# EAGLE design ESP_NeoPixel (EAGLE 9.2.0)
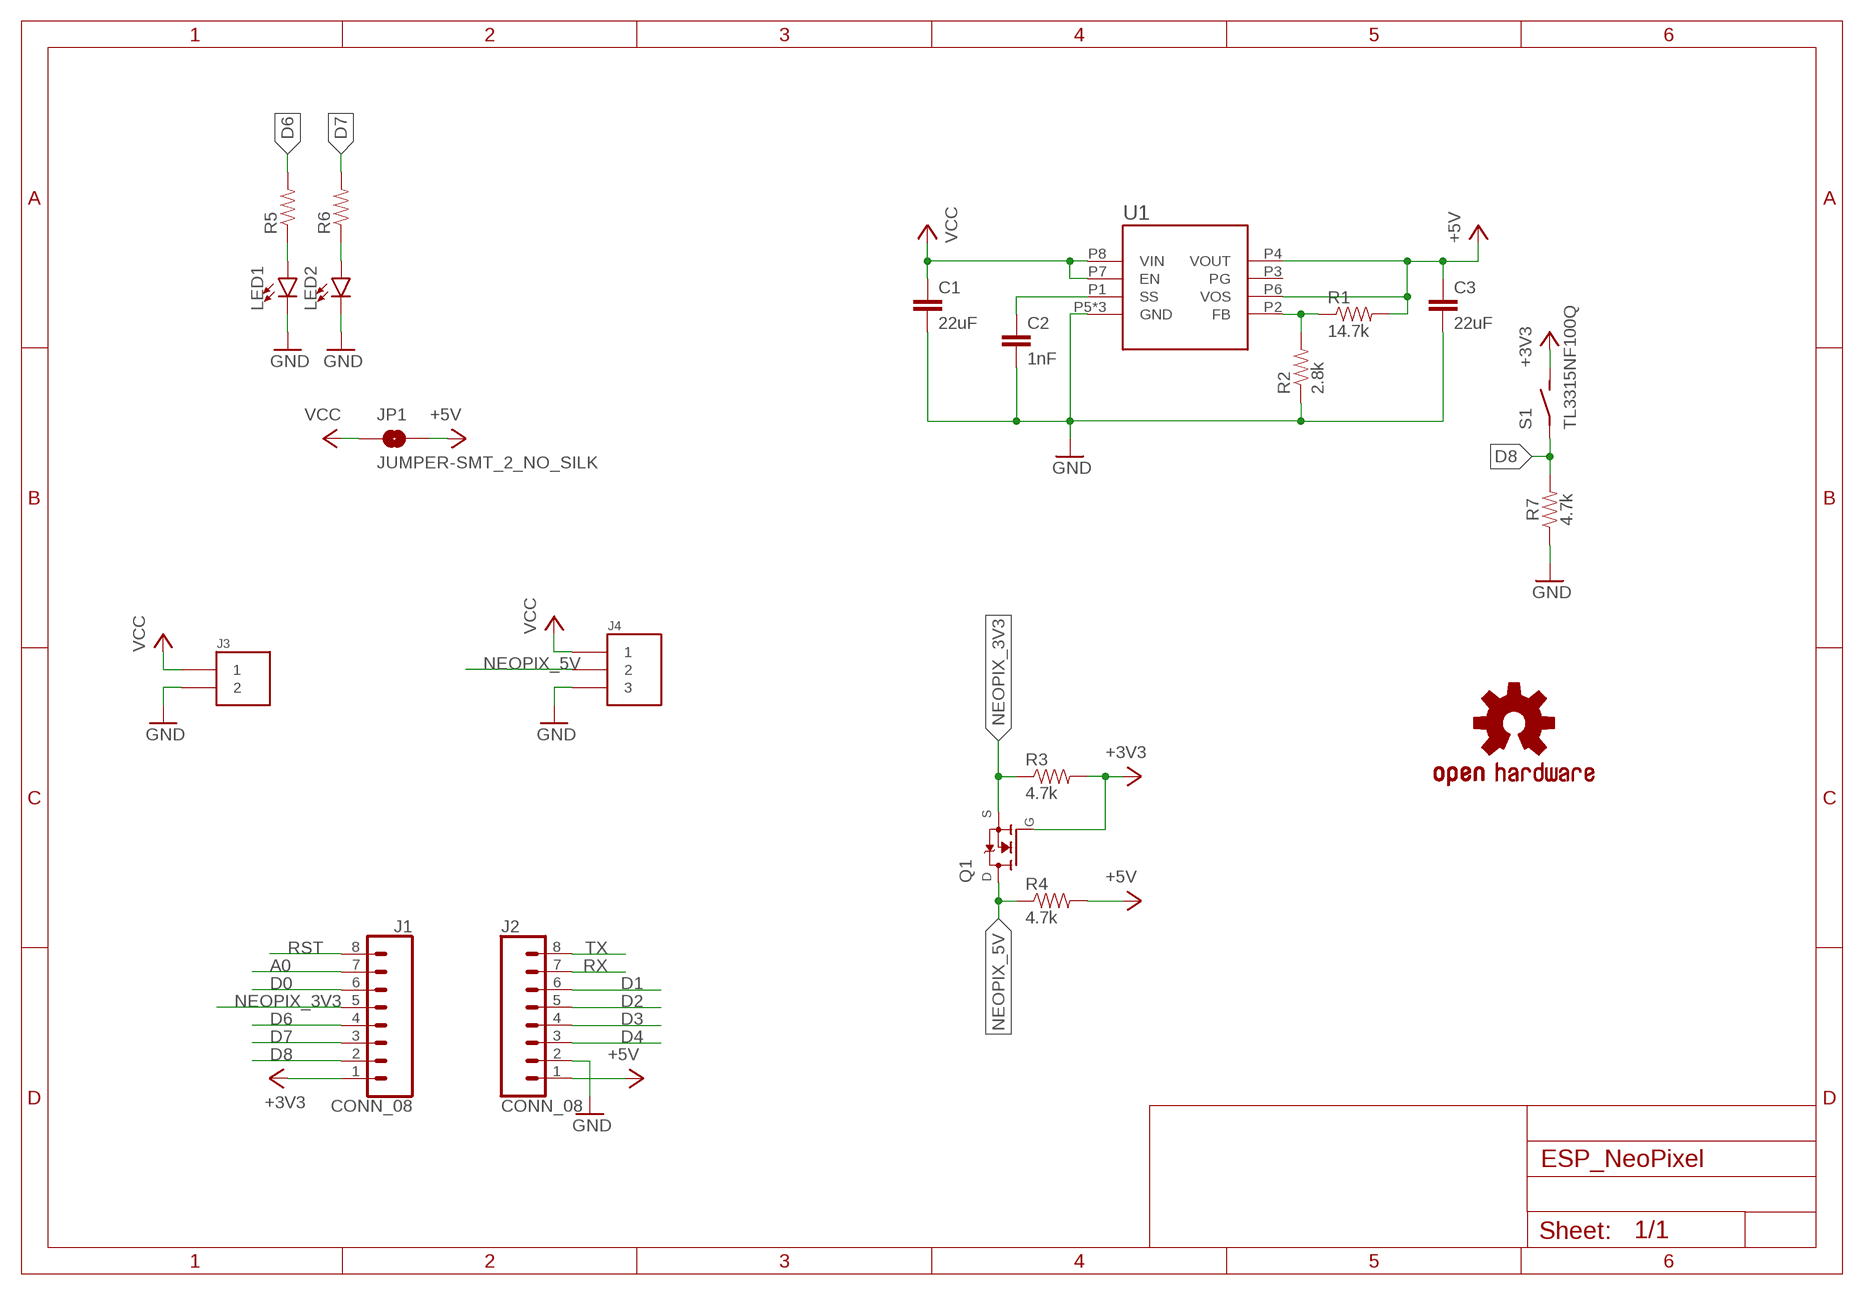
[diagram p0: schematic, sheet 1]

## Parts
C1  22uF  22UF-0805-6.3V-20%  [0805]
C2  1nF  1.0NF/1000PF-0603-50V-10%  [0603]
C3  22uF  22UF-0805-6.3V-20%  [0805]
J1  CONN_08  [1X08_LOCK_NO_SILK]
J2  CONN_08  [1X08_LOCK_NO_SILK]
J3  MKDS3-2-5.00  [MKDS3-2-5.00]
J4  MKDS3-3-5.00  [MKDS3-3-5.00]
JP1  JUMPER-SMT_2_NO_SILK  [SMT-JUMPER_2_NO_SILK]
LED1  LED0603  [LED-0603]
LED2  LED0603  [LED-0603]
LOGO1  OSHW-LOGOS  [OSHW-LOGO-S]
Q1  BSN20,215  [BSN20_215]
R1  14.7k  RESISTOR0603  [0603]
R2  2.8k  RESISTOR0603  [0603]
R3  4.7k  4.7KOHM-0603-1/10W-1%  [0603]
R4  4.7k  4.7KOHM-0603-1/10W-1%  [0603]
R5  RESISTOR0603  [0603]
R6  RESISTOR0603  [0603]
R7  4.7k  RESISTOR0603  [0603]
S1  TL3315NF100Q  [TL3315NF100Q]
U1  LMZ21700  [SIL0008E]

## Nets
+3V3: J1.1 Q1.1(G) R3.2 S1.P3(S) S1.P4(S)
+5V: C3.1 J2.1 JP1.2 R1.2 R4.2 U1.P4(VOUT) U1.P6(VOS)
A0: J1.7
D0: J1.6
D1: J2.6
D2: J2.5
D3: J2.4
D4: J2.3
D6: J1.4 R5.2
D7: J1.3 R6.2
D8: J1.2 R7.2 S1.P1(P) S1.P2(P)
GND: C1.2 C2.2 C3.2 J2.2 J3.2 J4.3 LED1.C LED2.C R2.1 R7.1 U1.P5(GND) U1.P9(GND) U1.P10(GND)
N$1: R1.1 R2.2 U1.P2(FB)
N$2: C2.1 U1.P1(SS)
N$3: LED1.A R5.1
N$4: LED2.A R6.1
NEOPIX_3V3: J1.5 Q1.2(S) R3.1
NEOPIX_5V: J4.2 Q1.3(D) R4.1
RST: J1.8
RX: J2.7
TX: J2.8
VCC: C1.1 J3.1 J4.1 JP1.1 U1.P7(EN) U1.P8(VIN)
Unconnected: U1.P3(PG)

## Library data of the parts
C1 C3 = SparkFun-Capacitors:22UF: 22µF ceramic capacitors A capacitor is a passive two-terminal electrical component used to store electrical energy temporarily in an electric field.; PROD_ID: CAP-08402
C2 = SparkFun-Capacitors:1.0NF/1000PF: 1nF/1,000pF ceramic capacitors A capacitor is a passive two-terminal electrical component used to store electrical energy temporarily in an electric field.; PROD_ID: CAP-07886
J1 J2 = jonas_Sparkfun-Connectors:CONN_08
J3 = jonas-phoenix:MKDS3-2-5.00
J4 = jonas-phoenix:MKDS3-3-5.00
JP1 = SparkFun-Jumpers:JUMPER-SMT_2_NO: Normally open jumper This jumper has two pads in close proximity to each other. Apply solder to close the connection. Round pads are easier to solder for beginners, but are a lot larger. SparkFun Product that uses the round pads: SparkFun EL Sequencer <https://www.sparkfun.com/products/12781>
LED1 LED2 = SparkFun-LED:LED: LED (Generic) Standard schematic elements and footprints for 5mm, 3mm, 1206, and 0603 sized LEDs. Generic LEDs with no color specified.
LOGO1 = SparkFun-Aesthetics:OSHW-LOGO: Open-Source Hardware (OSHW) Logo This logo indicates the piece of hardware it is found on incorporates a OSHW license and/or adheres to the definition of open source hardware found here: http://freedomdefined.org/OSHW
Q1 = jonas_mosfet:BSN20,215: BSN20 N chan with source-drain diode handy for I2C voltage shifter; AVAILABILITY: Good; DESCRIPTION: BSN Series 50 V 15 Ohm 0.83 W N-Channel Enhancement Mode Transistor - SOT-23; MF: NXP Semiconductors; MP: BSN20,215; PACKAGE: TO-236 NXP Semiconductors; PRICE: 0.17 USD
R1 R2 R5-R7 = SparkFun-Resistors:RESISTOR: Generic Resistor Package
R3 R4 = SparkFun-Resistors:4.7KOHM: 4.7kΩ resistor A resistor is a passive two-terminal electrical component that implements electrical resistance as a circuit element. Resistors act to reduce current flow, and, at the same time, act to lower voltage levels within circuits. - Wikipedia; PROD_ID: RES-07857
S1 = jonas-switch:TL3315NF100Q
U1 = jonas_ti:LMZ21700

## Board
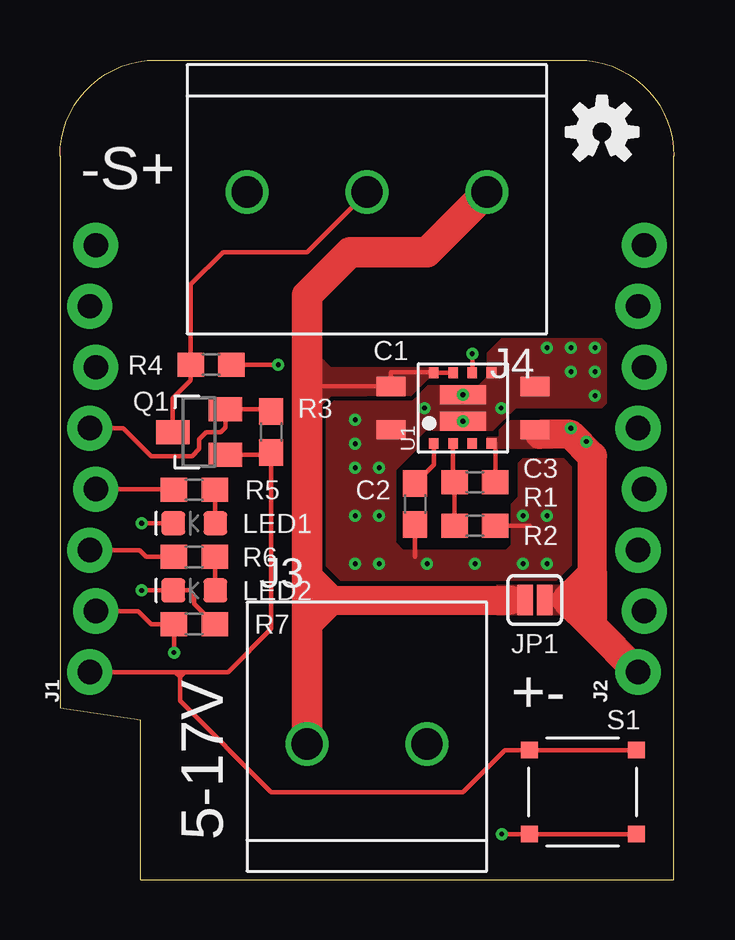
[diagram p1: board, top side]
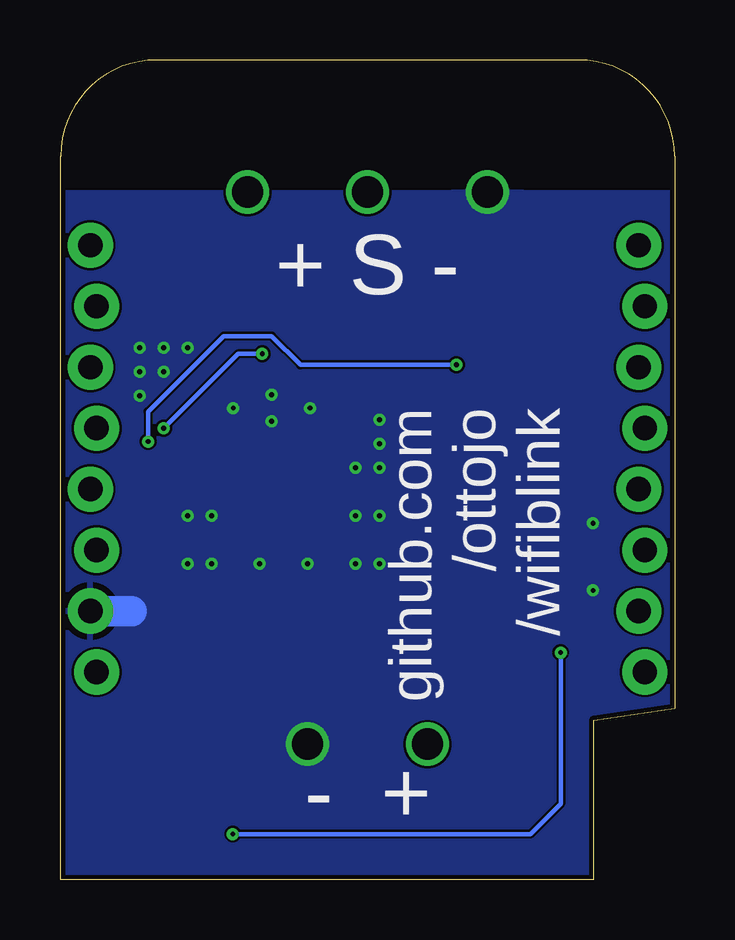
[diagram p2: board, bottom side, seen from below]

Size 25.6 x 34.15 mm. Coordinates in mm from the lower left corner, seen from the top.
Outline: 25.6,0 25.6,30.15 arc90 21.6,34.15 4,34.15 arc90 0,30.15 0,7.15 3.37,6.65 3.37,0 25.6,0
Copper layers (1*16): Top 0.035mm / dielectric 1.5mm / Bottom 0.035mm
Design rules "aisler_2_layer *": minimum track width 7mil, minimum drill 0.2mm, track to track 0.1mm, track to pad 0.1mm, pad to pad 0.1mm, via to via 0.1mm, smd to smd 0.1mm, copper to edge 0.2mm, drill to drill 0.21mm, minimum pad ring 0.25mm, minimum via ring 0.15mm, stop-mask expansion 0mil, vias tented up to drill 0.2mm, thermal gap 10mil

### Footprints (pad centres in the part's own frame; a part is rotated, then mirrored left to right if it is on the bottom)
0805 = smd 0.8 x 1.2: 1 -0.9,0; 2 0.9,0
0603 = smd 1.1 x 1: 1 -0.85,0; 2 0.85,0
1X08_LOCK_NO_SILK = drill 1.016 pad 1.88: 1 0,0.127; 2 2.54,-0.127; 3 5.08,0.127; 4 7.62,-0.127; 5 10.16,0.127; 6 12.7,-0.127; 7 15.24,0.127; 8 17.78,-0.127
MKDS3-2-5.00 = drill 1.3: 1 0,0; 2 5,0
MKDS3-3-5.00 = drill 1.3: 1 0,0; 2 5,0; 3 10,0
SMT-JUMPER_2_NO_SILK = smd 0.635 x 1.27: 1 -0.406,0; 2 0.406,0
LED-0603 = smd 1 x 1: A -0.877,0; C 0.877,0
BSN20_215 = smd 1 x 1.4: 1 -0.95,-1.1; 2 0.95,-1.1; 3 0,1.1
TL3315NF100Q = smd 0.7 x 0.7: P1 -2.225,1.75; P2 2.225,1.75; P3 -2.225,-1.75; P4 2.225,-1.75
SIL0008E = smd 0.45 x 0.4: P1 -1.475,1.21; P2 -1.475,0.41; P3 -1.475,-0.39; P4 -1.475,-1.19; P5 1.475,-1.19; P6 1.475,-0.39; P7 1.475,0.41; P8 1.475,1.21 | smd 0.8 x 1.9: P9 -0.55,0; P10 0.55,0

### Placement (x,y rotation side)
C1  13.8,19.65 270 top
C2  14.8,15.65 270 top
C3  19.8,19.65 90 top
J1  1.37,8.65 90 top
J2  24.23,8.65 90 top
J3  10.3,5.65 0 top
J4  17.8,28.65 180 top
JP1  19.8,11.65 0 top
LED1  5.6,14.85 180 top
LED2  5.6,12.05 180 top
LOGO1  22.6,31.15 0 top
Q1  5.8,18.65 90 top
R1  17.3,16.55 0 top
R2  17.3,14.75 180 top
R3  8.8,18.65 270 top
R4  6.3,21.45 0 top
R5  5.6,16.25 180 top
R6  5.6,13.45 180 top
R7  5.6,10.65 180 top
S1  21.8,3.65 180 top
U1  16.8,19.65 90 top

### Tracks (layer width: path | path; a pad name or v marks a point on that pad's centre or on a via)
+3V3
  Top 0.178: Q1.1 8.7,17.7 R3.2 8.8,10.45 7,8.65 5.2,8.65 | 4.8,8.65 J1.1 | 5,8.45 5,7.45 8.8,3.65 16.8,3.65 18.55,5.4 S1.P4 S1.P3 | 5.2,8.65 5,8.45 | 5,8.45 4.8,8.65 | 4.8,8.65 5.2,8.65
+5V  (via drill 0.2)
  Top 0.178: U1.P6 v17.19,21.91 | R1.2 18.15,18.18 U1.P4 | v21.3,18.81 21.3,18.55 | v21.95,18.25 22.2,18 22.2,17.65 | R4.2 v9.1,21.45
  Top 1.2: 22.2,10.55 J2.1 | 22.2,12.75 22.2,17.65 21.3,18.55 20,18.55 | 22.2,12.75 22.2,10.55 | 22.2,10.55 21.1,11.65 22.2,12.75
  Bottom 0.178: v17.19,21.91 18.2,21.91 v21.3,18.81 | v21.95,18.25 21.95,19.5 18.8,22.65 16.8,22.65 15.6,21.45 v9.1,21.45
  pour Top (no thermals): 17.8,17.95 20.54,17.95 20.54,19.15 18.7,19.15 18.3,18.75 18.3,18.45 17.8,18.45
  pour Top (no thermals): 19.9,12.28 22.6,12.28 22.6,11.02 19.9,11.02
D6
  Top 0.178: J1.4 4.73,16.27 R5.2
D7
  Top 0.178: J1.3 3.32,13.73 3.6,13.45 R6.2
D8  (via drill 0.2)
  Top 0.178: J1.2 3.26,11.19 3.8,10.65 R7.2 v4.75,9.46 | v18.42,1.9 S1.P2 S1.P1
  Bottom 0.178: v4.75,9.46 4.75,3.17 6.02,1.9 v18.42,1.9
GND  (via drill 0.2)
  Top 0.178: C2.2 14.8,13.45 | R2.1 19.6,14.75 | LED1.C v3.4,14.85 | v3.4,12.05 LED2.C 5.4,12.05 5.6,11.85 5.6,11.5 R7.1
  Bottom 1.27: J2.2 22.64,11.19
  other vias: 16.8,19.1 16.8,20.2 15.2,19.65 18.4,19.65 12.31,19.16 12.31,18.16 21.31,21.16 21.31,22.16 20.31,22.16 12.31,17.16 13.31,17.16 22.31,20.16 22.31,21.16 22.31,22.16 13.31,15.16 12.31,15.16 12.31,13.16 13.31,13.16 15.31,13.16 17.31,13.16 19.31,13.16 20.31,13.16 20.31,15.16 19.31,15.16
  pour Bottom (no thermals): 13.8,7.65 16.8,7.65 16.8,3.65 13.8,3.65
  pour Bottom (rank 6): -0.2,28.65 -0.2,-0.35 25.8,-0.35 25.8,28.65
  pour Bottom (no thermals): 6.3,28.75 9.3,28.75 9.3,26.75 6.3,26.75
  pour Top (no thermals): 14.7,19.95 11.4,19.95 11.1,19.65 11.1,13.05 11.7,12.45 20.7,12.45 21.35,13.1 21.35,17.2 21,17.55 19.3,17.55 19.1,17.35 19.1,15.95 18.8,15.65 18.8,13.95 18.6,13.75 14.3,13.75 14,14.05 14,17.05 14.9,17.95 14.9,18.35 15.25,18.7 18.05,18.7 19,19.65 22.6,19.65 22.8,19.85 22.8,22.35 22.6,22.55 18.4,22.55 17.8,21.95 17.8,20.95 17.45,20.6 15.35,20.6
N$1
  Top 0.178: R2.2 R1.1 16.39,16.55 U1.P2
N$2
  Top 0.178: U1.P1 15.59,17.29 C2.1
N$3
  Top 0.178: LED1.A 6.48,16.22 R5.1
N$4
  Top 0.178: LED2.A 6.48,13.42 R6.1
NEOPIX_3V3
  Top 0.178: J1.5 2.64,18.81 3.8,17.65 5.5,17.65 5.8,17.95 5.8,18.35 6.1,18.65 6.7,18.65 6.9,18.85 Q1.2 8.7,19.6 R3.1
NEOPIX_5V
  Top 0.178: Q1.3 4.7,20.05 5.45,20.8 R4.1 5.45,24.8 6.8,26.15 10.3,26.15 J4.2
VCC
  Top 0.178: U1.P7 U1.P8 15.57,21.15 13.8,21.15 C1.1 10.4,20.55 10.3,20.65
  Top 0.254: 18.8,11.65 JP1.1
  Top 1.2: 10.3,11.65 11.3,11.65 | 11.3,11.65 10.3,12.65 | 11.3,11.65 10.3,10.65 | 11.3,11.65 18.8,11.65
  Top 1.27: J3.1 10.3,10.65 10.3,11.65 10.3,12.65 10.3,20.65 10.3,24.35 12.1,26.15 15.3,26.15 J4.1
  pour Top (no thermals): 19.6,11.02 18.2,11.02 18.2,12.28 19.6,12.28
  pour Top (no thermals): 12.8,20.15 14.4,20.15 14.64,20.15 15.39,20.9 15.79,20.9 15.79,21.35 11.3,21.35 10.5,22.15 9.8,22.15 9.8,19.15 10.3,19.15 11.3,20.15

### Text on the board
tPlace: -S+ | +- | 5-17V
bPlace: + S - | github.com / /ottojo / /wifiblink | - +